# Altium schematic sheet E17-PDU-LOAD_1.SchDoc
size A4
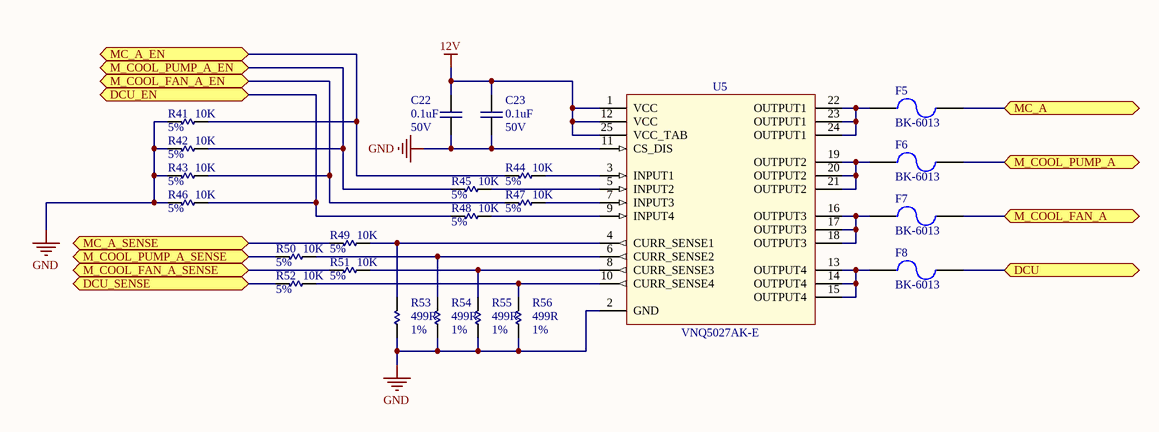
[diagram p0: E17-PDU-LOAD_1.SchDoc]

## Parts
C22  value 0.1uF  Voltage: 50V  [C0805]  (hidden comment: C_0805_Generic)
C23  value 0.1uF  Voltage: 50V  [C0805]  (hidden comment: C_0805_Generic)
F5  F_BK-6013  [BK-6013]  (value not drawn)
F6  F_BK-6013  [BK-6013]  (value not drawn)
F7  F_BK-6013  [BK-6013]  (value not drawn)
F8  F_BK-6013  [BK-6013]  (value not drawn)
R41  value 10K  Tolerance: 5%  [R0603]  (hidden comment: R_0603_Generic)
R42  value 10K  Tolerance: 5%  [R0603]  (hidden comment: R_0603_Generic)
R43  value 10K  Tolerance: 5%  [R0603]  (hidden comment: R_0603_Generic)
R44  value 10K  Tolerance: 5%  [R0603]  (hidden comment: R_0603_Generic)
R45  value 10K  Tolerance: 5%  [R0603]  (hidden comment: R_0603_Generic)
R46  value 10K  Tolerance: 5%  [R0603]  (hidden comment: R_0603_Generic)
R47  value 10K  Tolerance: 5%  [R0603]  (hidden comment: R_0603_Generic)
R48  value 10K  Tolerance: 5%  [R0603]  (hidden comment: R_0603_Generic)
R49  value 10K  Tolerance: 5%  [R0603]  (hidden comment: R_0603_Generic)
R50  value 10K  Tolerance: 5%  [R0603]  (hidden comment: R_0603_Generic)
R51  value 10K  Tolerance: 5%  [R0603]  (hidden comment: R_0603_Generic)
R52  value 10K  Tolerance: 5%  [R0603]  (hidden comment: R_0603_Generic)
R53  value 499R  Tolerance: 1%  [R0603]  (hidden comment: R_0603_Generic)
R54  value 499R  Tolerance: 1%  [R0603]  (hidden comment: R_0603_Generic)
R55  value 499R  Tolerance: 1%  [R0603]  (hidden comment: R_0603_Generic)
R56  value 499R  Tolerance: 1%  [R0603]  (hidden comment: R_0603_Generic)
U5  MFG_PN: VNQ5027AK-E  [PowerSSO-24]  (hidden comment: U_VNQ5027AK-E)

## Ports
DCU, DCU_EN, DCU_SENSE, M_COOL_FAN_A, M_COOL_FAN_A_EN, M_COOL_FAN_A_SENSE, M_COOL_PUMP_A, M_COOL_PUMP_A_EN, M_COOL_PUMP_A_SENSE, MC_A, MC_A_EN, MC_A_SENSE

## Nets
12V: C22.1(EGND) C23.1(EGND) U5.1(VCC) U5.12(VCC) U5.25(VCC_TAB)
GND: C22.2 C23.2 R41.1 R42.1 R43.1 R46.1 R53.2 R54.2 R55.2 R56.2 U5.2(GND) U5.11(CS_DIS)
DCU: F8.2 ; port DCU
DCU_EN: R46.2 R48.1 ; port DCU_EN
DCU_SENSE: R52.1 ; port DCU_SENSE
M_COOL_FAN_A: F7.2 ; port M_COOL_FAN_A
M_COOL_FAN_A_EN: R43.2 R47.1 ; port M_COOL_FAN_A_EN
M_COOL_FAN_A_SENSE: R51.1 ; port M_COOL_FAN_A_SENSE
M_COOL_PUMP_A: F6.2 ; port M_COOL_PUMP_A
M_COOL_PUMP_A_EN: R42.2 R45.1 ; port M_COOL_PUMP_A_EN
M_COOL_PUMP_A_SENSE: R50.1 ; port M_COOL_PUMP_A_SENSE
MC_A: F5.2 ; port MC_A
MC_A_EN: R41.2 R44.1 ; port MC_A_EN
MC_A_SENSE: R49.1 ; port MC_A_SENSE
NetF5_1: F5.1 U5.22(OUTPUT1) U5.23(OUTPUT1) U5.24(OUTPUT1)
NetF6_1: F6.1 U5.19(OUTPUT2) U5.20(OUTPUT2) U5.21(OUTPUT2)
NetF7_1: F7.1 U5.16(OUTPUT3) U5.17(OUTPUT3) U5.18(OUTPUT3)
NetF8_1: F8.1 U5.13(OUTPUT4) U5.14(OUTPUT4) U5.15(OUTPUT4)
NetR44_2: R44.2 U5.3(INPUT1)
NetR45_2: R45.2 U5.5(INPUT2)
NetR47_2: R47.2 U5.7(INPUT3)
NetR48_2: R48.2 U5.9(INPUT4)
NetR49_2: R49.2 R53.1 U5.4(CURR_SENSE1)
NetR50_2: R50.2 R54.1 U5.6(CURR_SENSE2)
NetR51_2: R51.2 R55.1 U5.8(CURR_SENSE3)
NetR52_2: R52.2 R56.1 U5.10(CURR_SENSE4)

## Library data of the parts
C22 C23 = C_0805_Generic: Generic 0805 Capacitor; Tolerance: 10%; Supplier: Digikey; Supplier_PN: 399-1170-1-ND
F5-F8 = F_BK-6013: FUSE HOLDER BLADE PCB; MFG: MPD; Supplier: Digikey; Supplier_PN: BK-6013-ND; MFG_PN: BK-6013
R41-R52 = R_0603_Generic: Generic 0603 Resistor; Power: 1/10W; Supplier: Digikey; Supplier_PN: P10KGCT-ND
R53-R56 = R_0603_Generic: Generic 0603 Resistor; Power: 1/8W; Supplier: Digikey; Supplier_PN: RNCP0603FTD499RCT-ND
U5 = U_VNQ5027AK-E: LOAD CHANNEL HIGH SIDE 42A 4 Channel; MFG: STmicroelectronics; Supplier_PN: 497-11715-1-ND; Supplier: Digikey